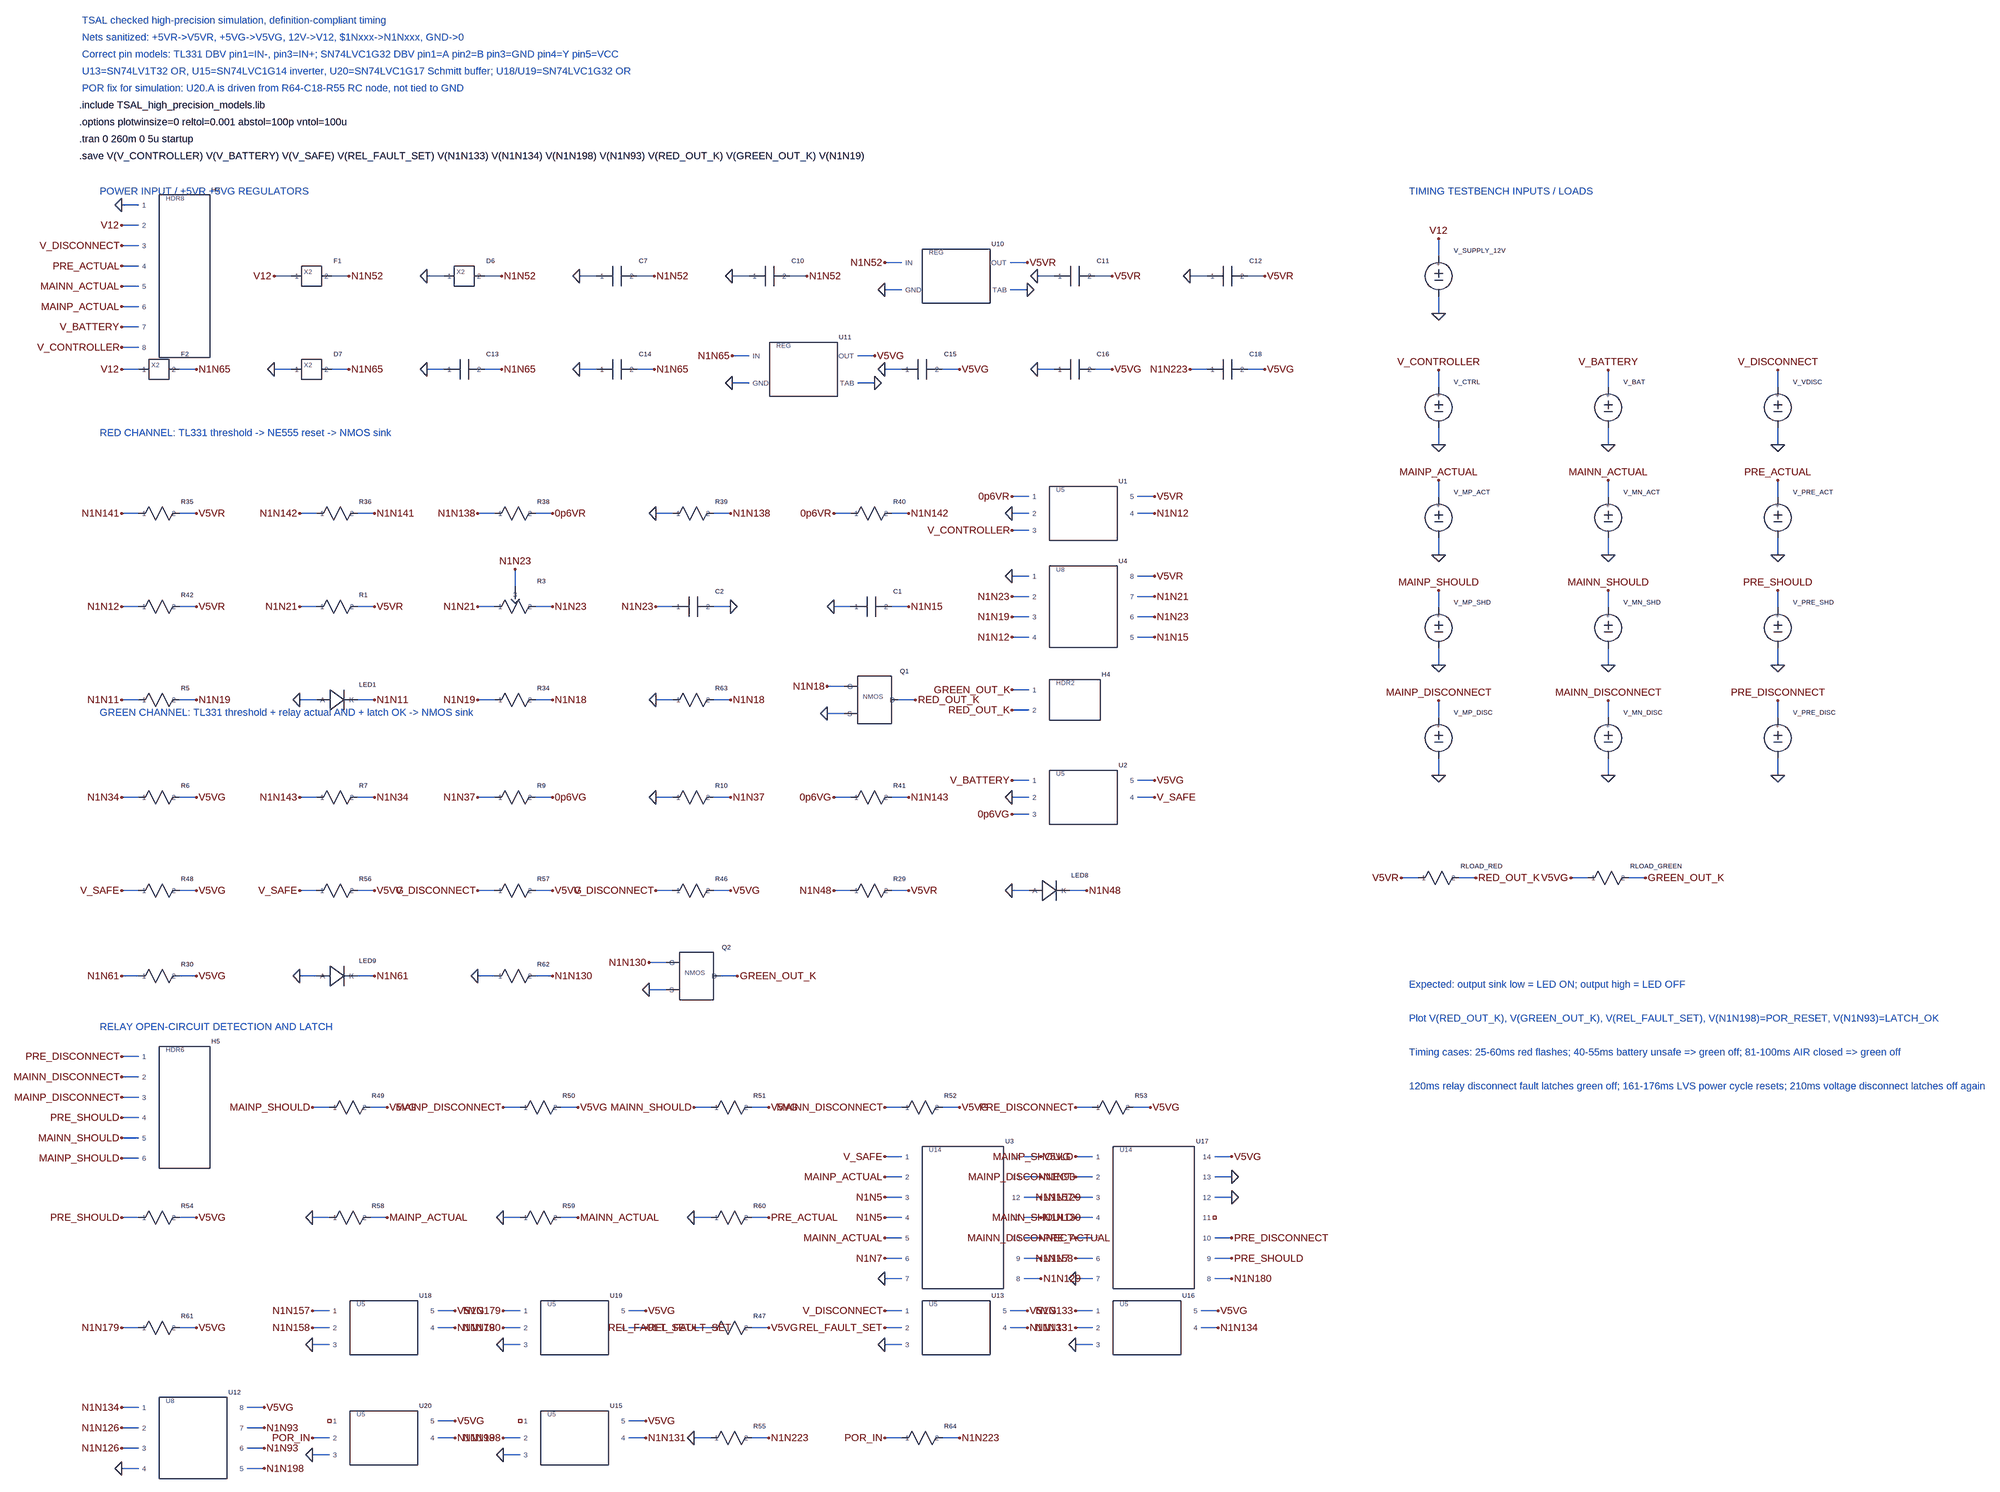
[diagram p0: schematic TSAL_checked_high_precision.asc]
TSAL_checked_high_precision.asc, the LTspice schematic file:
Version 4
SHEET 1 5600 3900
TEXT 32 16 Left 2 ; TSAL checked high-precision simulation, definition-compliant timing
TEXT 32 56 Left 2 ; Nets sanitized: +5VR->V5VR, +5VG->V5VG, 12V->V12, $1Nxxx->N1Nxxx, GND->0
TEXT 32 96 Left 2 ; Correct pin models: TL331 DBV pin1=IN-, pin3=IN+; SN74LVC1G32 DBV pin1=A pin2=B pin3=GND pin4=Y pin5=VCC
TEXT 32 136 Left 2 ; U13=SN74LV1T32 OR, U15=SN74LVC1G14 inverter, U20=SN74LVC1G17 Schmitt buffer; U18/U19=SN74LVC1G32 OR
TEXT 32 176 Left 2 ; POR fix for simulation: U20.A is driven from R64-C18-R55 RC node, not tied to GND
TEXT 32 216 Left 2 !.include TSAL_high_precision_models.lib
TEXT 32 256 Left 2 !.options plotwinsize=0 reltol=0.001 abstol=100p vntol=100u
TEXT 32 296 Left 2 !.tran 0 260m 0 5u startup
TEXT 32 336 Left 2 !.save V(V_CONTROLLER) V(V_BATTERY) V(V_SAFE) V(REL_FAULT_SET) V(N1N133) V(N1N134) V(N1N198) V(N1N93) V(RED_OUT_K) V(GREEN_OUT_K) V(N1N19)
TEXT 80 420 Left 2 ;POWER INPUT / +5VR +5VG REGULATORS
TEXT 80 990 Left 2 ;RED CHANNEL: TL331 threshold -> NE555 reset -> NMOS sink
TEXT 80 1650 Left 2 ;GREEN CHANNEL: TL331 threshold + relay actual AND + latch OK -> NMOS sink
TEXT 80 2410 Left 2 ;RELAY OPEN-CIRCUIT DETECTION AND LATCH
TEXT 3650 420 Left 2 ;TIMING TESTBENCH INPUTS / LOADS
TEXT 3650 2310 Left 2 ;Expected: output sink low = LED ON; output high = LED OFF
SYMBOL TSAL_HDR8 220 620 R0
SYMATTR InstName H3
SYMATTR Value HDR8_OPEN
WIRE 172 452 132 452
FLAG 132 452 0
WIRE 172 500 132 500
FLAG 132 500 V12
WIRE 172 548 132 548
FLAG 132 548 V_DISCONNECT
WIRE 172 596 132 596
FLAG 132 596 PRE_ACTUAL
WIRE 172 644 132 644
FLAG 132 644 MAINN_ACTUAL
WIRE 172 692 132 692
FLAG 132 692 MAINP_ACTUAL
WIRE 172 740 132 740
FLAG 132 740 V_BATTERY
WIRE 172 788 132 788
FLAG 132 788 V_CONTROLLER
SYMBOL TSAL_X2 580 620 R0
SYMATTR InstName F1
SYMATTR Value SMD2920P075TF_MACRO
WIRE 532 620 492 620
FLAG 492 620 V12
WIRE 628 620 668 620
FLAG 668 620 N1N52
SYMBOL TSAL_X2 940 620 R0
SYMATTR InstName D6
SYMATTR Value SMBJ18CA_MACRO
WIRE 892 620 852 620
FLAG 852 620 0
WIRE 988 620 1028 620
FLAG 1028 620 N1N52
SYMBOL TSAL_C 1300 620 R0
SYMATTR InstName C7
SYMATTR Value 220n
WIRE 1252 620 1212 620
FLAG 1212 620 0
WIRE 1348 620 1388 620
FLAG 1388 620 N1N52
SYMBOL TSAL_C 1660 620 R0
SYMATTR InstName C10
SYMATTR Value 10u
WIRE 1612 620 1572 620
FLAG 1572 620 0
WIRE 1708 620 1748 620
FLAG 1748 620 N1N52
SYMBOL TSAL_U4REG 2020 620 R0
SYMATTR InstName U10
SYMATTR Value LM340MP_5V
WIRE 1972 588 1932 588
FLAG 1932 588 N1N52
WIRE 1972 652 1932 652
FLAG 1932 652 0
WIRE 2228 588 2268 588
FLAG 2268 588 V5VR
WIRE 2228 652 2268 652
FLAG 2268 652 0
SYMBOL TSAL_C 2380 620 R0
SYMATTR InstName C11
SYMATTR Value 10u
WIRE 2332 620 2292 620
FLAG 2292 620 0
WIRE 2428 620 2468 620
FLAG 2468 620 V5VR
SYMBOL TSAL_C 2740 620 R0
SYMATTR InstName C12
SYMATTR Value 100n
WIRE 2692 620 2652 620
FLAG 2652 620 0
WIRE 2788 620 2828 620
FLAG 2828 620 V5VR
SYMBOL TSAL_X2 220 840 R0
SYMATTR InstName F2
SYMATTR Value SMD2920P075TF_MACRO
WIRE 172 840 132 840
FLAG 132 840 V12
WIRE 268 840 308 840
FLAG 308 840 N1N65
SYMBOL TSAL_X2 580 840 R0
SYMATTR InstName D7
SYMATTR Value SMBJ18CA_MACRO
WIRE 532 840 492 840
FLAG 492 840 0
WIRE 628 840 668 840
FLAG 668 840 N1N65
SYMBOL TSAL_C 940 840 R0
SYMATTR InstName C13
SYMATTR Value 220n
WIRE 892 840 852 840
FLAG 852 840 0
WIRE 988 840 1028 840
FLAG 1028 840 N1N65
SYMBOL TSAL_C 1300 840 R0
SYMATTR InstName C14
SYMATTR Value 10u
WIRE 1252 840 1212 840
FLAG 1212 840 0
WIRE 1348 840 1388 840
FLAG 1388 840 N1N65
SYMBOL TSAL_U4REG 1660 840 R0
SYMATTR InstName U11
SYMATTR Value LM340MP_5V
WIRE 1612 808 1572 808
FLAG 1572 808 N1N65
WIRE 1612 872 1572 872
FLAG 1572 872 0
WIRE 1868 808 1908 808
FLAG 1908 808 V5VG
WIRE 1868 872 1908 872
FLAG 1908 872 0
SYMBOL TSAL_C 2020 840 R0
SYMATTR InstName C15
SYMATTR Value 10u
WIRE 1972 840 1932 840
FLAG 1932 840 0
WIRE 2068 840 2108 840
FLAG 2108 840 V5VG
SYMBOL TSAL_C 2380 840 R0
SYMATTR InstName C16
SYMATTR Value 100n
WIRE 2332 840 2292 840
FLAG 2292 840 0
WIRE 2428 840 2468 840
FLAG 2468 840 V5VG
SYMBOL TSAL_C 2740 840 R0
SYMATTR InstName C18
SYMATTR Value 1u
WIRE 2692 840 2652 840
FLAG 2652 840 N1N223
WIRE 2788 840 2828 840
FLAG 2828 840 V5VG
SYMBOL TSAL_R 220 1180 R0
SYMATTR InstName R35
SYMATTR Value 200k
WIRE 172 1180 132 1180
FLAG 132 1180 N1N141
WIRE 268 1180 308 1180
FLAG 308 1180 V5VR
SYMBOL TSAL_R 640 1180 R0
SYMATTR InstName R36
SYMATTR Value 200k
WIRE 592 1180 552 1180
FLAG 552 1180 N1N142
WIRE 688 1180 728 1180
FLAG 728 1180 N1N141
SYMBOL TSAL_R 1060 1180 R0
SYMATTR InstName R38
SYMATTR Value 40k
WIRE 1012 1180 972 1180
FLAG 972 1180 N1N138
WIRE 1108 1180 1148 1180
FLAG 1148 1180 0p6VR
SYMBOL TSAL_R 1480 1180 R0
SYMATTR InstName R39
SYMATTR Value 20k
WIRE 1432 1180 1392 1180
FLAG 1392 1180 0
WIRE 1528 1180 1568 1180
FLAG 1568 1180 N1N138
SYMBOL TSAL_R 1900 1180 R0
SYMATTR InstName R40
SYMATTR Value 40k
WIRE 1852 1180 1812 1180
FLAG 1812 1180 0p6VR
WIRE 1948 1180 1988 1180
FLAG 1988 1180 N1N142
SYMBOL TSAL_U5 2320 1180 R0
SYMATTR InstName U1
SYMATTR Value TL331IDBVR
WIRE 2272 1140 2232 1140
FLAG 2232 1140 0p6VR
WIRE 2272 1180 2232 1180
FLAG 2232 1180 0
WIRE 2272 1220 2232 1220
FLAG 2232 1220 V_CONTROLLER
WIRE 2528 1180 2568 1180
FLAG 2568 1180 N1N12
WIRE 2528 1140 2568 1140
FLAG 2568 1140 V5VR
SYMBOL TSAL_R 220 1400 R0
SYMATTR InstName R42
SYMATTR Value 10k
WIRE 172 1400 132 1400
FLAG 132 1400 N1N12
WIRE 268 1400 308 1400
FLAG 308 1400 V5VR
SYMBOL TSAL_R 640 1400 R0
SYMATTR InstName R1
SYMATTR Value 2k
WIRE 592 1400 552 1400
FLAG 552 1400 N1N21
WIRE 688 1400 728 1400
FLAG 728 1400 V5VR
SYMBOL TSAL_POT3 1060 1400 R0
SYMATTR InstName R3
SYMATTR Value POT_TIED
SYMATTR SpiceLine PARAMS: R=25k
WIRE 1012 1400 972 1400
FLAG 972 1400 N1N21
WIRE 1108 1400 1148 1400
FLAG 1148 1400 N1N23
WIRE 1060 1352 1060 1312
FLAG 1060 1312 N1N23
SYMBOL TSAL_C 1480 1400 R0
SYMATTR InstName C2
SYMATTR Value 10u
WIRE 1432 1400 1392 1400
FLAG 1392 1400 N1N23
WIRE 1528 1400 1568 1400
FLAG 1568 1400 0
SYMBOL TSAL_C 1900 1400 R0
SYMATTR InstName C1
SYMATTR Value 10n
WIRE 1852 1400 1812 1400
FLAG 1812 1400 0
WIRE 1948 1400 1988 1400
FLAG 1988 1400 N1N15
SYMBOL TSAL_U8 2320 1400 R0
SYMATTR InstName U4
SYMATTR Value NE555DR_HP
WIRE 2272 1328 2232 1328
FLAG 2232 1328 0
WIRE 2272 1376 2232 1376
FLAG 2232 1376 N1N23
WIRE 2272 1424 2232 1424
FLAG 2232 1424 N1N19
WIRE 2272 1472 2232 1472
FLAG 2232 1472 N1N12
WIRE 2528 1472 2568 1472
FLAG 2568 1472 N1N15
WIRE 2528 1424 2568 1424
FLAG 2568 1424 N1N23
WIRE 2528 1376 2568 1376
FLAG 2568 1376 N1N21
WIRE 2528 1328 2568 1328
FLAG 2568 1328 V5VR
SYMBOL TSAL_R 220 1620 R0
SYMATTR InstName R5
SYMATTR Value 2.2k
WIRE 172 1620 132 1620
FLAG 132 1620 N1N11
WIRE 268 1620 308 1620
FLAG 308 1620 N1N19
SYMBOL TSAL_DIODE 640 1620 R0
SYMATTR InstName LED1
SYMATTR Value DLED_RED
WIRE 592 1620 552 1620
FLAG 552 1620 0
WIRE 688 1620 728 1620
FLAG 728 1620 N1N11
SYMBOL TSAL_R 1060 1620 R0
SYMATTR InstName R34
SYMATTR Value 1k
WIRE 1012 1620 972 1620
FLAG 972 1620 N1N19
WIRE 1108 1620 1148 1620
FLAG 1148 1620 N1N18
SYMBOL TSAL_R 1480 1620 R0
SYMATTR InstName R63
SYMATTR Value 10k
WIRE 1432 1620 1392 1620
FLAG 1392 1620 0
WIRE 1528 1620 1568 1620
FLAG 1568 1620 N1N18
SYMBOL TSAL_NMOS3 1900 1620 R0
SYMATTR InstName Q1
SYMATTR Value AO3480C_MACRO
WIRE 1836 1588 1796 1588
FLAG 1796 1588 N1N18
WIRE 1836 1652 1796 1652
FLAG 1796 1652 0
WIRE 1964 1620 2004 1620
FLAG 2004 1620 RED_OUT_K
SYMBOL TSAL_HDR2 2320 1620 R0
SYMATTR InstName H4
SYMATTR Value HDR2_OPEN
WIRE 2272 1596 2232 1596
FLAG 2232 1596 GREEN_OUT_K
WIRE 2272 1644 2232 1644
FLAG 2232 1644 RED_OUT_K
SYMBOL TSAL_R 220 1850 R0
SYMATTR InstName R6
SYMATTR Value 200k
WIRE 172 1850 132 1850
FLAG 132 1850 N1N34
WIRE 268 1850 308 1850
FLAG 308 1850 V5VG
SYMBOL TSAL_R 640 1850 R0
SYMATTR InstName R7
SYMATTR Value 200k
WIRE 592 1850 552 1850
FLAG 552 1850 N1N143
WIRE 688 1850 728 1850
FLAG 728 1850 N1N34
SYMBOL TSAL_R 1060 1850 R0
SYMATTR InstName R9
SYMATTR Value 40k
WIRE 1012 1850 972 1850
FLAG 972 1850 N1N37
WIRE 1108 1850 1148 1850
FLAG 1148 1850 0p6VG
SYMBOL TSAL_R 1480 1850 R0
SYMATTR InstName R10
SYMATTR Value 20k
WIRE 1432 1850 1392 1850
FLAG 1392 1850 0
WIRE 1528 1850 1568 1850
FLAG 1568 1850 N1N37
SYMBOL TSAL_R 1900 1850 R0
SYMATTR InstName R41
SYMATTR Value 40k
WIRE 1852 1850 1812 1850
FLAG 1812 1850 0p6VG
WIRE 1948 1850 1988 1850
FLAG 1988 1850 N1N143
SYMBOL TSAL_U5 2320 1850 R0
SYMATTR InstName U2
SYMATTR Value TL331IDBVR
WIRE 2272 1810 2232 1810
FLAG 2232 1810 V_BATTERY
WIRE 2272 1850 2232 1850
FLAG 2232 1850 0
WIRE 2272 1890 2232 1890
FLAG 2232 1890 0p6VG
WIRE 2528 1850 2568 1850
FLAG 2568 1850 V_SAFE
WIRE 2528 1810 2568 1810
FLAG 2568 1810 V5VG
SYMBOL TSAL_R 220 2070 R0
SYMATTR InstName R48
SYMATTR Value 10k
WIRE 172 2070 132 2070
FLAG 132 2070 V_SAFE
WIRE 268 2070 308 2070
FLAG 308 2070 V5VG
SYMBOL TSAL_R 640 2070 R0
SYMATTR InstName R56
SYMATTR Value 10k
WIRE 592 2070 552 2070
FLAG 552 2070 V_SAFE
WIRE 688 2070 728 2070
FLAG 728 2070 V5VG
SYMBOL TSAL_R 1060 2070 R0
SYMATTR InstName R57
SYMATTR Value 10k
WIRE 1012 2070 972 2070
FLAG 972 2070 V_DISCONNECT
WIRE 1108 2070 1148 2070
FLAG 1148 2070 V5VG
SYMBOL TSAL_R 1480 2070 R0
SYMATTR InstName R46
SYMATTR Value 10k
WIRE 1432 2070 1392 2070
FLAG 1392 2070 V_DISCONNECT
WIRE 1528 2070 1568 2070
FLAG 1568 2070 V5VG
SYMBOL TSAL_R 1900 2070 R0
SYMATTR InstName R29
SYMATTR Value 1k
WIRE 1852 2070 1812 2070
FLAG 1812 2070 N1N48
WIRE 1948 2070 1988 2070
FLAG 1988 2070 V5VR
SYMBOL TSAL_DIODE 2320 2070 R0
SYMATTR InstName LED8
SYMATTR Value DLED_RED
WIRE 2272 2070 2232 2070
FLAG 2232 2070 0
WIRE 2368 2070 2408 2070
FLAG 2408 2070 N1N48
SYMBOL TSAL_R 220 2290 R0
SYMATTR InstName R30
SYMATTR Value 1k
WIRE 172 2290 132 2290
FLAG 132 2290 N1N61
WIRE 268 2290 308 2290
FLAG 308 2290 V5VG
SYMBOL TSAL_DIODE 640 2290 R0
SYMATTR InstName LED9
SYMATTR Value DLED_RED
WIRE 592 2290 552 2290
FLAG 552 2290 0
WIRE 688 2290 728 2290
FLAG 728 2290 N1N61
SYMBOL TSAL_R 1060 2290 R0
SYMATTR InstName R62
SYMATTR Value 10k
WIRE 1012 2290 972 2290
FLAG 972 2290 0
WIRE 1108 2290 1148 2290
FLAG 1148 2290 N1N130
SYMBOL TSAL_NMOS3 1480 2290 R0
SYMATTR InstName Q2
SYMATTR Value AO3480C_MACRO
WIRE 1416 2258 1376 2258
FLAG 1376 2258 N1N130
WIRE 1416 2322 1376 2322
FLAG 1376 2322 0
WIRE 1544 2290 1584 2290
FLAG 1584 2290 GREEN_OUT_K
SYMBOL TSAL_HDR6 220 2600 R0
SYMATTR InstName H5
SYMATTR Value HDR6_OPEN
WIRE 172 2480 132 2480
FLAG 132 2480 PRE_DISCONNECT
WIRE 172 2528 132 2528
FLAG 132 2528 MAINN_DISCONNECT
WIRE 172 2576 132 2576
FLAG 132 2576 MAINP_DISCONNECT
WIRE 172 2624 132 2624
FLAG 132 2624 PRE_SHOULD
WIRE 172 2672 132 2672
FLAG 132 2672 MAINN_SHOULD
WIRE 172 2720 132 2720
FLAG 132 2720 MAINP_SHOULD
SYMBOL TSAL_R 670 2600 R0
SYMATTR InstName R49
SYMATTR Value 10k
WIRE 622 2600 582 2600
FLAG 582 2600 MAINP_SHOULD
WIRE 718 2600 758 2600
FLAG 758 2600 V5VG
SYMBOL TSAL_R 1120 2600 R0
SYMATTR InstName R50
SYMATTR Value 10k
WIRE 1072 2600 1032 2600
FLAG 1032 2600 MAINP_DISCONNECT
WIRE 1168 2600 1208 2600
FLAG 1208 2600 V5VG
SYMBOL TSAL_R 1570 2600 R0
SYMATTR InstName R51
SYMATTR Value 10k
WIRE 1522 2600 1482 2600
FLAG 1482 2600 MAINN_SHOULD
WIRE 1618 2600 1658 2600
FLAG 1658 2600 V5VG
SYMBOL TSAL_R 2020 2600 R0
SYMATTR InstName R52
SYMATTR Value 10k
WIRE 1972 2600 1932 2600
FLAG 1932 2600 MAINN_DISCONNECT
WIRE 2068 2600 2108 2600
FLAG 2108 2600 V5VG
SYMBOL TSAL_R 2470 2600 R0
SYMATTR InstName R53
SYMATTR Value 10k
WIRE 2422 2600 2382 2600
FLAG 2382 2600 PRE_DISCONNECT
WIRE 2518 2600 2558 2600
FLAG 2558 2600 V5VG
SYMBOL TSAL_R 220 2860 R0
SYMATTR InstName R54
SYMATTR Value 10k
WIRE 172 2860 132 2860
FLAG 132 2860 PRE_SHOULD
WIRE 268 2860 308 2860
FLAG 308 2860 V5VG
SYMBOL TSAL_R 670 2860 R0
SYMATTR InstName R58
SYMATTR Value 10k
WIRE 622 2860 582 2860
FLAG 582 2860 0
WIRE 718 2860 758 2860
FLAG 758 2860 MAINP_ACTUAL
SYMBOL TSAL_R 1120 2860 R0
SYMATTR InstName R59
SYMATTR Value 10k
WIRE 1072 2860 1032 2860
FLAG 1032 2860 0
WIRE 1168 2860 1208 2860
FLAG 1208 2860 MAINN_ACTUAL
SYMBOL TSAL_R 1570 2860 R0
SYMATTR InstName R60
SYMATTR Value 10k
WIRE 1522 2860 1482 2860
FLAG 1482 2860 0
WIRE 1618 2860 1658 2860
FLAG 1658 2860 PRE_ACTUAL
SYMBOL TSAL_U14 2020 2860 R0
SYMATTR InstName U3
SYMATTR Value CD74HC08
WIRE 1972 2716 1932 2716
FLAG 1932 2716 V_SAFE
WIRE 1972 2764 1932 2764
FLAG 1932 2764 MAINP_ACTUAL
WIRE 1972 2812 1932 2812
FLAG 1932 2812 N1N5
WIRE 1972 2860 1932 2860
FLAG 1932 2860 N1N5
WIRE 1972 2908 1932 2908
FLAG 1932 2908 MAINN_ACTUAL
WIRE 1972 2956 1932 2956
FLAG 1932 2956 N1N7
WIRE 1972 3004 1932 3004
FLAG 1932 3004 0
WIRE 2260 3004 2300 3004
FLAG 2300 3004 N1N129
WIRE 2260 2956 2300 2956
FLAG 2300 2956 N1N7
WIRE 2260 2908 2300 2908
FLAG 2300 2908 PRE_ACTUAL
WIRE 2260 2860 2300 2860
FLAG 2300 2860 N1N130
WIRE 2260 2812 2300 2812
FLAG 2300 2812 N1N129
WIRE 2260 2764 2300 2764
FLAG 2300 2764 N1N93
WIRE 2260 2716 2300 2716
FLAG 2300 2716 V5VG
SYMBOL TSAL_U14 2470 2860 R0
SYMATTR InstName U17
SYMATTR Value CD74HC08
WIRE 2422 2716 2382 2716
FLAG 2382 2716 MAINP_SHOULD
WIRE 2422 2764 2382 2764
FLAG 2382 2764 MAINP_DISCONNECT
WIRE 2422 2812 2382 2812
FLAG 2382 2812 N1N157
WIRE 2422 2860 2382 2860
FLAG 2382 2860 MAINN_SHOULD
WIRE 2422 2908 2382 2908
FLAG 2382 2908 MAINN_DISCONNECT
WIRE 2422 2956 2382 2956
FLAG 2382 2956 N1N158
WIRE 2422 3004 2382 3004
FLAG 2382 3004 0
WIRE 2710 3004 2750 3004
FLAG 2750 3004 N1N180
WIRE 2710 2956 2750 2956
FLAG 2750 2956 PRE_SHOULD
WIRE 2710 2908 2750 2908
FLAG 2750 2908 PRE_DISCONNECT
WIRE 2710 2812 2750 2812
FLAG 2750 2812 0
WIRE 2710 2764 2750 2764
FLAG 2750 2764 0
WIRE 2710 2716 2750 2716
FLAG 2750 2716 V5VG
SYMBOL TSAL_R 220 3120 R0
SYMATTR InstName R61
SYMATTR Value 10k
WIRE 172 3120 132 3120
FLAG 132 3120 N1N179
WIRE 268 3120 308 3120
FLAG 308 3120 V5VG
SYMBOL TSAL_U5 670 3120 R0
SYMATTR InstName U18
SYMATTR Value SN74LVC1G32DBVR
WIRE 622 3080 582 3080
FLAG 582 3080 N1N157
WIRE 622 3120 582 3120
FLAG 582 3120 N1N158
WIRE 622 3160 582 3160
FLAG 582 3160 0
WIRE 878 3120 918 3120
FLAG 918 3120 N1N179
WIRE 878 3080 918 3080
FLAG 918 3080 V5VG
SYMBOL TSAL_U5 1120 3120 R0
SYMATTR InstName U19
SYMATTR Value SN74LVC1G32DBVR
WIRE 1072 3080 1032 3080
FLAG 1032 3080 N1N179
WIRE 1072 3120 1032 3120
FLAG 1032 3120 N1N180
WIRE 1072 3160 1032 3160
FLAG 1032 3160 0
WIRE 1328 3120 1368 3120
FLAG 1368 3120 REL_FAULT_SET
WIRE 1328 3080 1368 3080
FLAG 1368 3080 V5VG
SYMBOL TSAL_R 1570 3120 R0
SYMATTR InstName R47
SYMATTR Value 10k
WIRE 1522 3120 1482 3120
FLAG 1482 3120 REL_FAULT_SET
WIRE 1618 3120 1658 3120
FLAG 1658 3120 V5VG
SYMBOL TSAL_U5 2020 3120 R0
SYMATTR InstName U13
SYMATTR Value SN74LV1T32DBVR
WIRE 1972 3080 1932 3080
FLAG 1932 3080 V_DISCONNECT
WIRE 1972 3120 1932 3120
FLAG 1932 3120 REL_FAULT_SET
WIRE 1972 3160 1932 3160
FLAG 1932 3160 0
WIRE 2228 3120 2268 3120
FLAG 2268 3120 N1N133
WIRE 2228 3080 2268 3080
FLAG 2268 3080 V5VG
SYMBOL TSAL_U5 2470 3120 R0
SYMATTR InstName U16
SYMATTR Value SN74LV1T08DBVR
WIRE 2422 3080 2382 3080
FLAG 2382 3080 N1N133
WIRE 2422 3120 2382 3120
FLAG 2382 3120 N1N131
WIRE 2422 3160 2382 3160
FLAG 2382 3160 0
WIRE 2678 3120 2718 3120
FLAG 2718 3120 N1N134
WIRE 2678 3080 2718 3080
FLAG 2718 3080 V5VG
SYMBOL TSAL_U8 220 3380 R0
SYMATTR InstName U12
SYMATTR Value SN74LVC2G02DCTR
WIRE 172 3308 132 3308
FLAG 132 3308 N1N134
WIRE 172 3356 132 3356
FLAG 132 3356 N1N126
WIRE 172 3404 132 3404
FLAG 132 3404 N1N126
WIRE 172 3452 132 3452
FLAG 132 3452 0
WIRE 428 3452 468 3452
FLAG 468 3452 N1N198
WIRE 428 3404 468 3404
FLAG 468 3404 N1N93
WIRE 428 3356 468 3356
FLAG 468 3356 N1N93
WIRE 428 3308 468 3308
FLAG 468 3308 V5VG
SYMBOL TSAL_U5 670 3380 R0
SYMATTR InstName U20
SYMATTR Value SN74LVC1G17QDCKRQ1
WIRE 622 3380 582 3380
FLAG 582 3380 POR_IN
WIRE 622 3420 582 3420
FLAG 582 3420 0
WIRE 878 3380 918 3380
FLAG 918 3380 N1N198
WIRE 878 3340 918 3340
FLAG 918 3340 V5VG
SYMBOL TSAL_U5 1120 3380 R0
SYMATTR InstName U15
SYMATTR Value SN74LVC1G14DBVR
WIRE 1072 3380 1032 3380
FLAG 1032 3380 N1N198
WIRE 1072 3420 1032 3420
FLAG 1032 3420 0
WIRE 1328 3380 1368 3380
FLAG 1368 3380 N1N131
WIRE 1328 3340 1368 3340
FLAG 1368 3340 V5VG
SYMBOL TSAL_R 1570 3380 R0
SYMATTR InstName R55
SYMATTR Value 100k
WIRE 1522 3380 1482 3380
FLAG 1482 3380 0
WIRE 1618 3380 1658 3380
FLAG 1658 3380 N1N223
SYMBOL TSAL_R 2020 3380 R0
SYMATTR InstName R64
SYMATTR Value 1k
WIRE 1972 3380 1932 3380
FLAG 1932 3380 POR_IN
WIRE 2068 3380 2108 3380
FLAG 2108 3380 N1N223
SYMBOL TSAL_VSRC 3720 620 R0
SYMATTR InstName V_SUPPLY_12V
SYMATTR Value PWL(0 0 0.2m 12 160m 12 161m 0 175m 0 176m 12 260m 12)
WIRE 3720 572 3720 532
FLAG 3720 532 V12
WIRE 3720 668 3720 708
FLAG 3720 708 0
SYMBOL TSAL_VSRC 3720 930 R0
SYMATTR InstName V_CTRL
SYMATTR Value PWL(0 0 20m 0 25m 1 60m 1 65m 0 260m 0)
WIRE 3720 882 3720 842
FLAG 3720 842 V_CONTROLLER
WIRE 3720 978 3720 1018
FLAG 3720 1018 0
SYMBOL TSAL_VSRC 4120 930 R0
SYMATTR InstName V_BAT
SYMATTR Value PWL(0 0 35m 0 40m 1 50m 1 55m 0 260m 0)
WIRE 4120 882 4120 842
FLAG 4120 842 V_BATTERY
WIRE 4120 978 4120 1018
FLAG 4120 1018 0
SYMBOL TSAL_VSRC 4520 930 R0
SYMATTR InstName V_VDISC
SYMATTR Value PWL(0 0 209m 0 210m 5 220m 5 221m 0 260m 0)
WIRE 4520 882 4520 842
FLAG 4520 842 V_DISCONNECT
WIRE 4520 978 4520 1018
FLAG 4520 1018 0
SYMBOL TSAL_VSRC 3720 1190 R0
SYMATTR InstName V_MP_ACT
SYMATTR Value PWL(0 5 80m 5 81m 0 100m 0 101m 5 260m 5)
WIRE 3720 1142 3720 1102
FLAG 3720 1102 MAINP_ACTUAL
WIRE 3720 1238 3720 1278
FLAG 3720 1278 0
SYMBOL TSAL_VSRC 4120 1190 R0
SYMATTR InstName V_MN_ACT
SYMATTR Value DC 5
WIRE 4120 1142 4120 1102
FLAG 4120 1102 MAINN_ACTUAL
WIRE 4120 1238 4120 1278
FLAG 4120 1278 0
SYMBOL TSAL_VSRC 4520 1190 R0
SYMATTR InstName V_PRE_ACT
SYMATTR Value DC 5
WIRE 4520 1142 4520 1102
FLAG 4520 1102 PRE_ACTUAL
WIRE 4520 1238 4520 1278
FLAG 4520 1278 0
SYMBOL TSAL_VSRC 3720 1450 R0
SYMATTR InstName V_MP_SHD
SYMATTR Value DC 5
WIRE 3720 1402 3720 1362
FLAG 3720 1362 MAINP_SHOULD
WIRE 3720 1498 3720 1538
FLAG 3720 1538 0
SYMBOL TSAL_VSRC 4120 1450 R0
SYMATTR InstName V_MN_SHD
SYMATTR Value DC 5
WIRE 4120 1402 4120 1362
FLAG 4120 1362 MAINN_SHOULD
WIRE 4120 1498 4120 1538
FLAG 4120 1538 0
SYMBOL TSAL_VSRC 4520 1450 R0
SYMATTR InstName V_PRE_SHD
SYMATTR Value DC 5
WIRE 4520 1402 4520 1362
FLAG 4520 1362 PRE_SHOULD
WIRE 4520 1498 4520 1538
FLAG 4520 1538 0
SYMBOL TSAL_VSRC 3720 1710 R0
SYMATTR InstName V_MP_DISC
SYMATTR Value PWL(0 0 119m 0 120m 5 130m 5 131m 0 260m 0)
WIRE 3720 1662 3720 1622
FLAG 3720 1622 MAINP_DISCONNECT
WIRE 3720 1758 3720 1798
FLAG 3720 1798 0
SYMBOL TSAL_VSRC 4120 1710 R0
SYMATTR InstName V_MN_DISC
SYMATTR Value DC 0
WIRE 4120 1662 4120 1622
FLAG 4120 1622 MAINN_DISCONNECT
WIRE 4120 1758 4120 1798
FLAG 4120 1798 0
SYMBOL TSAL_VSRC 4520 1710 R0
SYMATTR InstName V_PRE_DISC
SYMATTR Value DC 0
WIRE 4520 1662 4520 1622
FLAG 4520 1622 PRE_DISCONNECT
WIRE 4520 1758 4520 1798
FLAG 4520 1798 0
SYMBOL TSAL_R 3720 2040 R0
SYMATTR InstName RLOAD_RED
SYMATTR Value 1k
WIRE 3672 2040 3632 2040
FLAG 3632 2040 V5VR
WIRE 3768 2040 3808 2040
FLAG 3808 2040 RED_OUT_K
SYMBOL TSAL_R 4120 2040 R0
SYMATTR InstName RLOAD_GREEN
SYMATTR Value 1k
WIRE 4072 2040 4032 2040
FLAG 4032 2040 V5VG
WIRE 4168 2040 4208 2040
FLAG 4208 2040 GREEN_OUT_K
TEXT 3650 2390 Left 2 ;Plot V(RED_OUT_K), V(GREEN_OUT_K), V(REL_FAULT_SET), V(N1N198)=POR_RESET, V(N1N93)=LATCH_OK
TEXT 3650 2470 Left 2 ;Timing cases: 25-60ms red flashes; 40-55ms battery unsafe => green off; 81-100ms AIR closed => green off
TEXT 3650 2550 Left 2 ;120ms relay disconnect fault latches green off; 161-176ms LVS power cycle resets; 210ms voltage disconnect latches off again

The netlist it stands for:
* TSAL_checked_high_precision.asc
XH3 0 V12 V_DISCONNECT PRE_ACTUAL MAINN_ACTUAL MAINP_ACTUAL V_BATTERY V_CONTROLLER HDR8_OPEN  ; pins 1 2 3 4 5 6 7 8
XF1 V12 N1N52 SMD2920P075TF_MACRO  ; pins 1 2
XD6 0 N1N52 SMBJ18CA_MACRO  ; pins 1 2
C7 0 N1N52 220n
C10 0 N1N52 10u
XU10 N1N52 0 V5VR 0 LM340MP_5V  ; pins IN GND OUT TAB
C11 0 V5VR 10u
C12 0 V5VR 100n
XF2 V12 N1N65 SMD2920P075TF_MACRO  ; pins 1 2
XD7 0 N1N65 SMBJ18CA_MACRO  ; pins 1 2
C13 0 N1N65 220n
C14 0 N1N65 10u
XU11 N1N65 0 V5VG 0 LM340MP_5V  ; pins IN GND OUT TAB
C15 0 V5VG 10u
C16 0 V5VG 100n
C18 N1N223 V5VG 1u
R35 N1N141 V5VR 200k
R36 N1N142 N1N141 200k
R38 N1N138 0p6VR 40k
R39 0 N1N138 20k
R40 0p6VR N1N142 40k
XU1 0p6VR 0 V_CONTROLLER N1N12 V5VR TL331IDBVR  ; pins 1 2 3 4 5
R42 N1N12 V5VR 10k
R1 N1N21 V5VR 2k
XR3 N1N21 N1N23 N1N23 POT_TIED PARAMS: R=25k  ; pins 1 2 3
C2 N1N23 0 10u
C1 0 N1N15 10n
XU4 0 N1N23 N1N19 N1N12 N1N15 N1N23 N1N21 V5VR NE555DR_HP  ; pins 1 2 3 4 5 6 7 8
R5 N1N11 N1N19 2.2k
D§LED1 0 N1N11 DLED_RED
R34 N1N19 N1N18 1k
R63 0 N1N18 10k
XQ1 N1N18 0 RED_OUT_K AO3480C_MACRO  ; pins G S D
XH4 GREEN_OUT_K RED_OUT_K HDR2_OPEN  ; pins 1 2
R6 N1N34 V5VG 200k
R7 N1N143 N1N34 200k
R9 N1N37 0p6VG 40k
R10 0 N1N37 20k
R41 0p6VG N1N143 40k
XU2 V_BATTERY 0 0p6VG V_SAFE V5VG TL331IDBVR  ; pins 1 2 3 4 5
R48 V_SAFE V5VG 10k
R56 V_SAFE V5VG 10k
R57 V_DISCONNECT V5VG 10k
R46 V_DISCONNECT V5VG 10k
R29 N1N48 V5VR 1k
D§LED8 0 N1N48 DLED_RED
R30 N1N61 V5VG 1k
D§LED9 0 N1N61 DLED_RED
R62 0 N1N130 10k
XQ2 N1N130 0 GREEN_OUT_K AO3480C_MACRO  ; pins G S D
XH5 PRE_DISCONNECT MAINN_DISCONNECT MAINP_DISCONNECT PRE_SHOULD MAINN_SHOULD MAINP_SHOULD HDR6_OPEN  ; pins 1 2 3 4 5 6
R49 MAINP_SHOULD V5VG 10k
R50 MAINP_DISCONNECT V5VG 10k
R51 MAINN_SHOULD V5VG 10k
R52 MAINN_DISCONNECT V5VG 10k
R53 PRE_DISCONNECT V5VG 10k
R54 PRE_SHOULD V5VG 10k
R58 0 MAINP_ACTUAL 10k
R59 0 MAINN_ACTUAL 10k
R60 0 PRE_ACTUAL 10k
XU3 V_SAFE MAINP_ACTUAL N1N5 N1N5 MAINN_ACTUAL N1N7 0 N1N129 N1N7 PRE_ACTUAL N1N130 N1N129 N1N93 V5VG CD74HC08  ; pins 1 2 3 4 5 6 7 8 9 10 11 12 13 14
XU17 MAINP_SHOULD MAINP_DISCONNECT N1N157 MAINN_SHOULD MAINN_DISCONNECT N1N158 0 N1N180 PRE_SHOULD PRE_DISCONNECT NC_01 0 0 V5VG CD74HC08  ; pins 1 2 3 4 5 6 7 8 9 10 11 12 13 14
R61 N1N179 V5VG 10k
XU18 N1N157 N1N158 0 N1N179 V5VG SN74LVC1G32DBVR  ; pins 1 2 3 4 5
XU19 N1N179 N1N180 0 REL_FAULT_SET V5VG SN74LVC1G32DBVR  ; pins 1 2 3 4 5
R47 REL_FAULT_SET V5VG 10k
XU13 V_DISCONNECT REL_FAULT_SET 0 N1N133 V5VG SN74LV1T32DBVR  ; pins 1 2 3 4 5
XU16 N1N133 N1N131 0 N1N134 V5VG SN74LV1T08DBVR  ; pins 1 2 3 4 5
XU12 N1N134 N1N126 N1N126 0 N1N198 N1N93 N1N93 V5VG SN74LVC2G02DCTR  ; pins 1 2 3 4 5 6 7 8
XU20 NC_02 POR_IN 0 N1N198 V5VG SN74LVC1G17QDCKRQ1  ; pins 1 2 3 4 5
XU15 NC_03 N1N198 0 N1N131 V5VG SN74LVC1G14DBVR  ; pins 1 2 3 4 5
R55 0 N1N223 100k
R64 POR_IN N1N223 1k
V_SUPPLY_12V V12 0 PWL(0 0 0.2m 12 160m 12 161m 0 175m 0 176m 12 260m 12)
V_CTRL V_CONTROLLER 0 PWL(0 0 20m 0 25m 1 60m 1 65m 0 260m 0)
V_BAT V_BATTERY 0 PWL(0 0 35m 0 40m 1 50m 1 55m 0 260m 0)
V_VDISC V_DISCONNECT 0 PWL(0 0 209m 0 210m 5 220m 5 221m 0 260m 0)
V_MP_ACT MAINP_ACTUAL 0 PWL(0 5 80m 5 81m 0 100m 0 101m 5 260m 5)
V_MN_ACT MAINN_ACTUAL 0 DC 5
V_PRE_ACT PRE_ACTUAL 0 DC 5
V_MP_SHD MAINP_SHOULD 0 DC 5
V_MN_SHD MAINN_SHOULD 0 DC 5
V_PRE_SHD PRE_SHOULD 0 DC 5
V_MP_DISC MAINP_DISCONNECT 0 PWL(0 0 119m 0 120m 5 130m 5 131m 0 260m 0)
V_MN_DISC MAINN_DISCONNECT 0 DC 0
V_PRE_DISC PRE_DISCONNECT 0 DC 0
RLOAD_RED V5VR RED_OUT_K 1k
RLOAD_GREEN V5VG GREEN_OUT_K 1k
.model D D
.lib standard.dio
*  TSAL checked high-precision simulation, definition-compliant timing
*  Nets sanitized: +5VR->V5VR, +5VG->V5VG, 12V->V12, $1Nxxx->N1Nxxx, GND->0
*  Correct pin models: TL331 DBV pin1=IN-, pin3=IN+; SN74LVC1G32 DBV pin1=A pin2=B pin3=GND pin4=Y pin5=VCC
*  U13=SN74LV1T32 OR, U15=SN74LVC1G14 inverter, U20=SN74LVC1G17 Schmitt buffer; U18/U19=SN74LVC1G32 OR
*  POR fix for simulation: U20.A is driven from R64-C18-R55 RC node, not tied to GND
.include TSAL_high_precision_models.lib
.options plotwinsize=0 reltol=0.001 abstol=100p vntol=100u
.tran 0 260m 0 5u startup
.save V(V_CONTROLLER) V(V_BATTERY) V(V_SAFE) V(REL_FAULT_SET) V(N1N133) V(N1N134) V(N1N198) V(N1N93) V(RED_OUT_K) V(GREEN_OUT_K) V(N1N19)
* POWER INPUT / +5VR +5VG REGULATORS
* RED CHANNEL: TL331 threshold -> NE555 reset -> NMOS sink
* GREEN CHANNEL: TL331 threshold + relay actual AND + latch OK -> NMOS sink
* RELAY OPEN-CIRCUIT DETECTION AND LATCH
* TIMING TESTBENCH INPUTS / LOADS
* Expected: output sink low = LED ON; output high = LED OFF
* Plot V(RED_OUT_K), V(GREEN_OUT_K), V(REL_FAULT_SET), V(N1N198)=POR_RESET, V(N1N93)=LATCH_OK
* Timing cases: 25-60ms red flashes; 40-55ms battery unsafe => green off; 81-100ms AIR closed => green off
* 120ms relay disconnect fault latches green off; 161-176ms LVS power cycle resets; 210ms voltage disconnect latches off again
.backanno
.end